# Altium schematic sheet MCX_Isolated_Mezzanine.SchDoc: DIO MCX 16 Isolated
size A3; Author: F.Świtakowski; CompanyName: WUT ISE; DrawnBy: F.Świtakowski; Organization: WUT ISE; Address1: PW ISE; Address2: Nowowiejska 15/19 00-665 Warsaw; DocumentNumber: 1; Revision: 2; SheetNumber: 1; SheetTotal: 2; ModifiedBy: -; CheckedDate: -; Title2: Mezzanine; DivGrp: WUT ISE; Designer: F.Świtakowski; ModifiedDate: -; ProjectName: Sensor Box
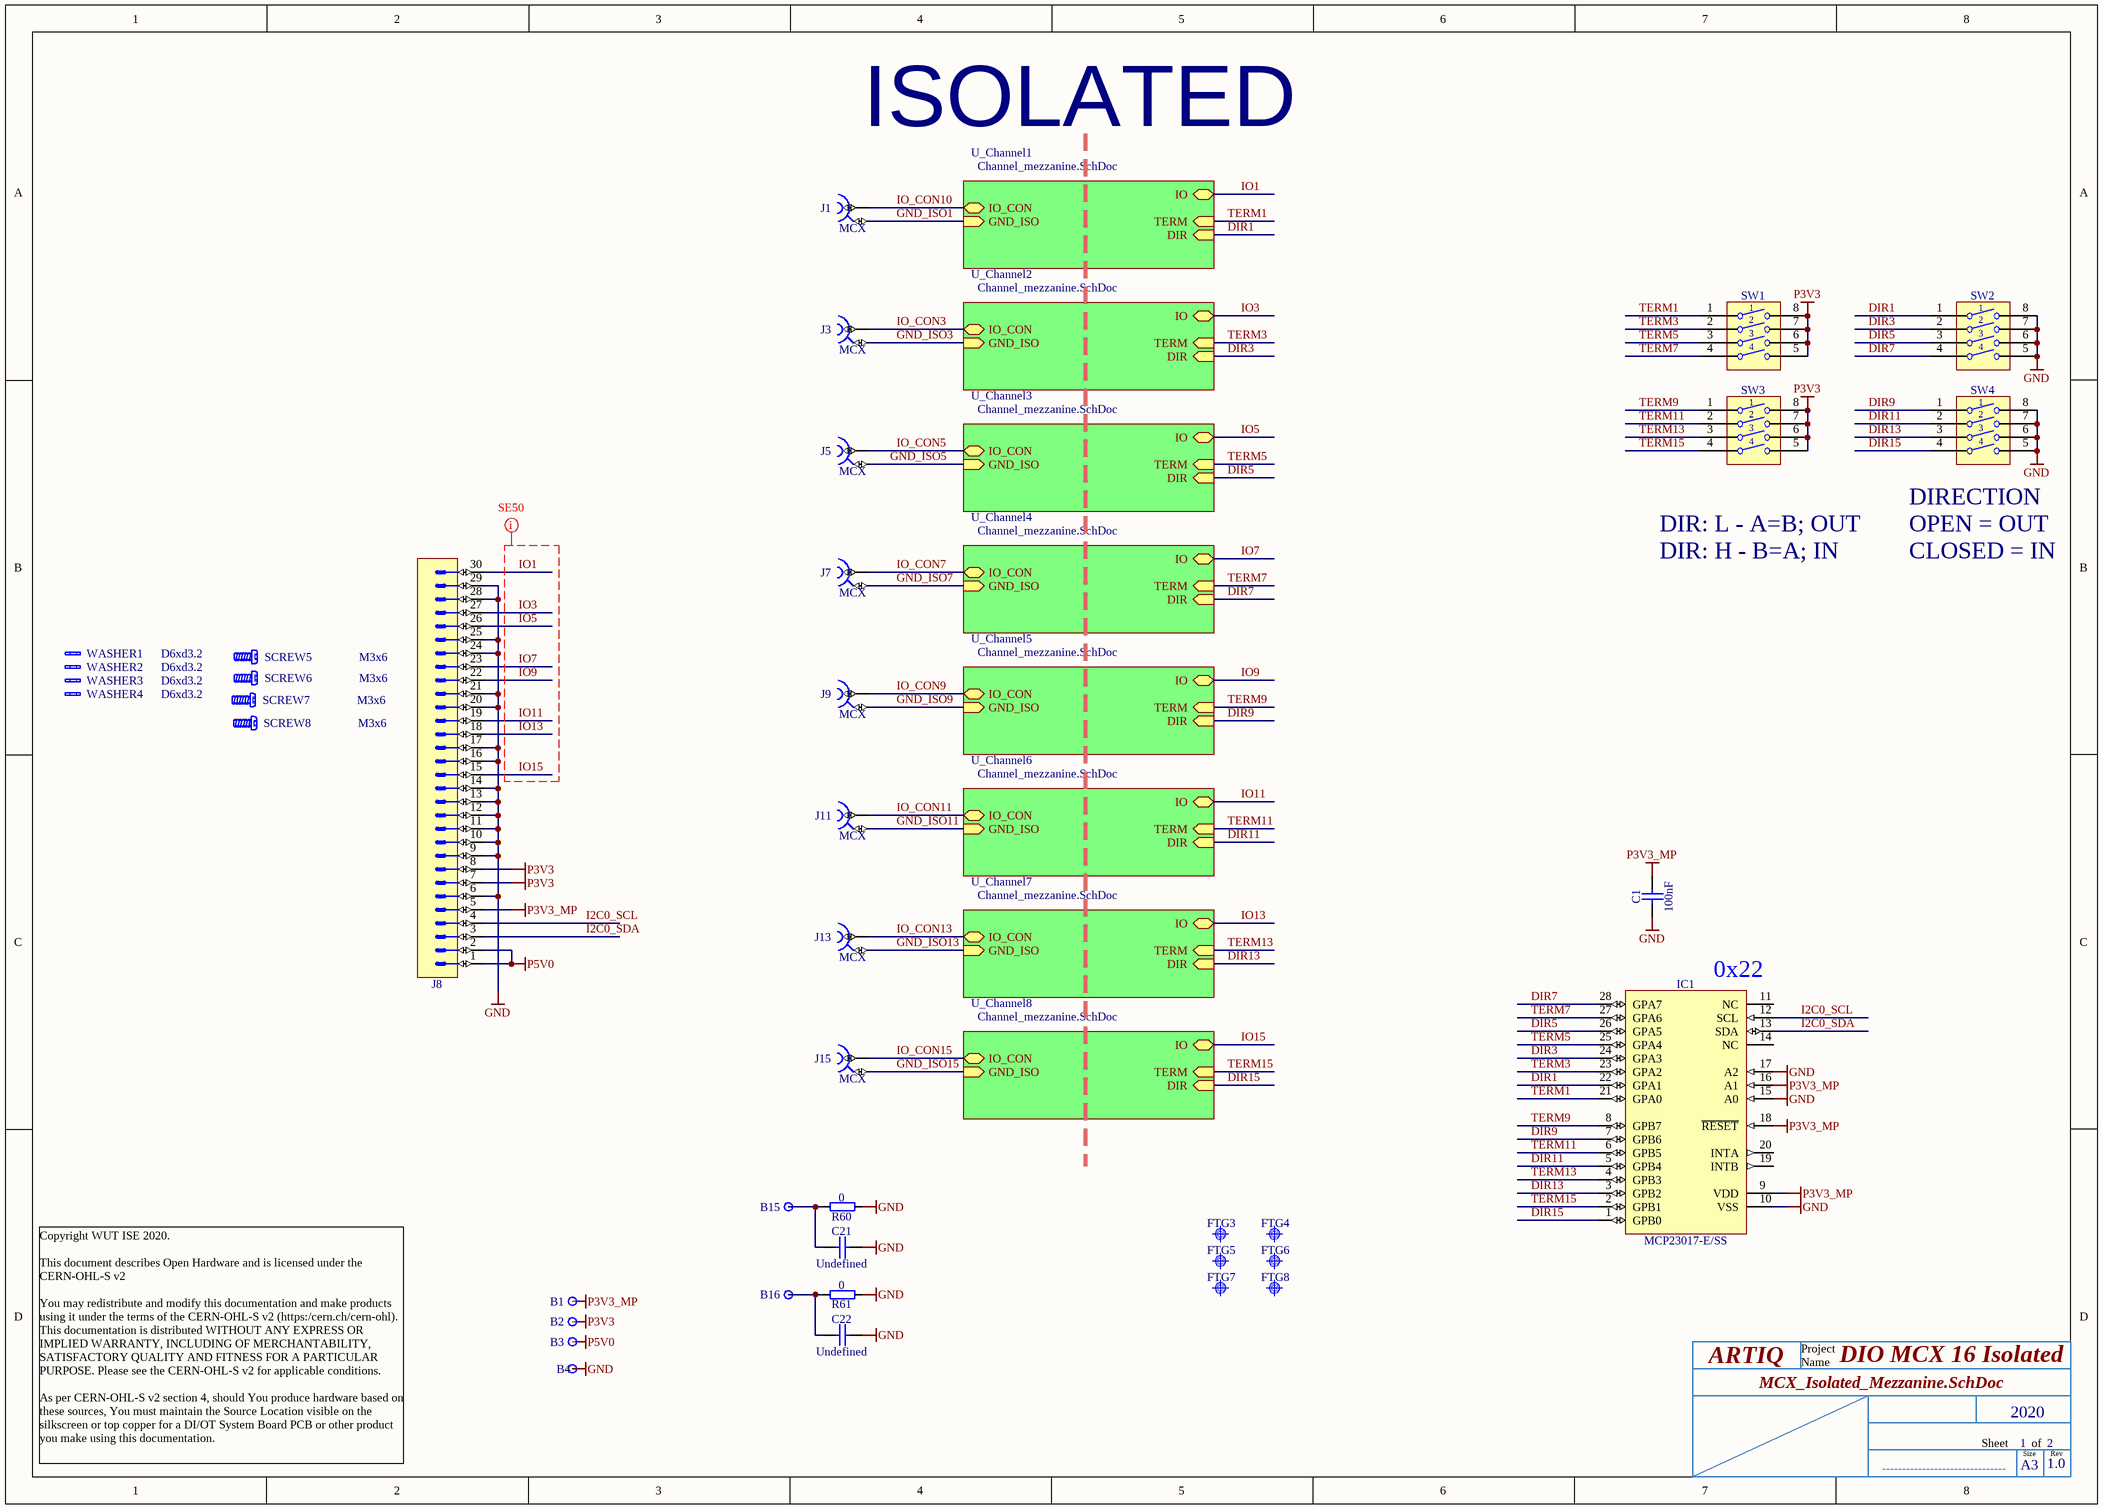
[diagram p0: MCX_Isolated_Mezzanine.SchDoc]

## Parts
B1  Plated Hole  [c130h60]  (value not drawn)
B2  Plated Hole  [c130h60]  (value not drawn)
B3  Plated Hole  [c130h60]  (value not drawn)
B4  Plated Hole  [c130h60]  (value not drawn)
B15  Plated Hole  [MTG270_500]  (value not drawn)
B16  Plated Hole  [MTG270_500]  (value not drawn)
C1  100nF  [CAPC1005X55N]
C21  Undefined  [CAPC2012X135N]
C22  Undefined  [CAPC2012X135N]
FTG3  Use only in PCB  [FIDUCIAL_TOP_S100-200]  (value not drawn)
FTG4  Use only in PCB  [FIDUCIAL_TOP_C100-200]  (value not drawn)
FTG5  Use only in PCB  [FIDUCIAL_TOP_S100-200]  (value not drawn)
FTG6  Use only in PCB  [FIDUCIAL_TOP_C100-200]  (value not drawn)
FTG7  Use only in PCB  [FIDUCIAL_TOP_C100-200]  (value not drawn)
FTG8  Use only in PCB  [FIDUCIAL_TOP_S100-200]  (value not drawn)
IC1  MCP23017-E/SS  [SOP65P780X200-28N]
J1  MCX  [BEL_133-3701-801]
J3  MCX  [BEL_133-3701-801]
J5  MCX  [BEL_133-3701-801]
J7  MCX  [BEL_133-3701-801]
J8  AMPMODU  [TYCO_1-215307-5]  (value not drawn)
J9  MCX  [BEL_133-3701-801]
J11  MCX  [BEL_133-3701-801]
J13  MCX  [BEL_133-3701-801]
J15  MCX  [BEL_133-3701-801]
R60  0  [RESC1608X55N]
R61  0  [RESC1608X55N]
SCREW5  M3x6  [BOSSARD_BN5687-3061605_v]
SCREW6  M3x6  [BOSSARD_BN5687-3061605_v]
SCREW7  M3x6  [BOSSARD_BN5687-3061605_v]
SCREW8  M3x6  [BOSSARD_BN5687-3061605_v]
SW1  Switch  [SW_OMRON_A6S-4102-H]  (value not drawn)
SW2  Switch  [SW_OMRON_A6S-4102-H]  (value not drawn)
SW3  Switch  [SW_OMRON_A6S-4102-H]  (value not drawn)
SW4  Switch  [SW_OMRON_A6S-4102-H]  (value not drawn)
WASHER1  D6xd3.2  [BOSSARD_B3/6/0.3/BN1976_v]
WASHER2  D6xd3.2  [BOSSARD_B3/6/0.3/BN1976_v]
WASHER3  D6xd3.2  [BOSSARD_B3/6/0.3/BN1976_v]
WASHER4  D6xd3.2  [BOSSARD_B3/6/0.3/BN1976_v]

## Sub-sheets
U_Channel1 = Channel_mezzanine.SchDoc: IO (bidir), TERM (in), DIR (in), IO_CON (bidir), GND_ISO (in)
U_Channel2 = Channel_mezzanine.SchDoc: IO (bidir), TERM (in), DIR (in), IO_CON (bidir), GND_ISO (in)
U_Channel3 = Channel_mezzanine.SchDoc: IO (bidir), TERM (in), DIR (in), IO_CON (bidir), GND_ISO (in)
U_Channel4 = Channel_mezzanine.SchDoc: IO (bidir), TERM (in), DIR (in), IO_CON (bidir), GND_ISO (in)
U_Channel5 = Channel_mezzanine.SchDoc: IO (bidir), TERM (in), DIR (in), IO_CON (bidir), GND_ISO (in)
U_Channel6 = Channel_mezzanine.SchDoc: IO (bidir), TERM (in), DIR (in), IO_CON (bidir), GND_ISO (in)
U_Channel7 = Channel_mezzanine.SchDoc: IO (bidir), TERM (in), DIR (in), IO_CON (bidir), GND_ISO (in)
U_Channel8 = Channel_mezzanine.SchDoc: IO (bidir), TERM (in), DIR (in), IO_CON (bidir), GND_ISO (in)

## Nets
GND: B4.1 C1.1 C21.2 C22.2 IC1.10(VSS) IC1.15(A0) IC1.17(A2) J8.6 J8.9 J8.10 J8.11 J8.12 J8.13 J8.14 J8.16 J8.17 J8.20 J8.21 J8.24 J8.25 J8.28 J8.29 R60.1 R61.1 SW2.5 SW2.6 SW2.7 SW2.8 SW4.5 SW4.6 SW4.7 SW4.8
P3V3: B2.1 J8.7 J8.8 SW1.5 SW1.6 SW1.7 SW1.8 SW3.5 SW3.6 SW3.7 SW3.8
P3V3_MP: B1.1 C1.2 IC1.9(VDD) IC1.16(A1) IC1.18(~{RESET}) J8.5
P5V0: B3.1 J8.1 J8.2
DIR1: IC1.22(GPA1) SW2.1 ; sheet U_Channel1/DIR
DIR3: IC1.24(GPA3) SW2.2 ; sheet U_Channel2/DIR
DIR5: IC1.26(GPA5) SW2.3 ; sheet U_Channel3/DIR
DIR7: IC1.28(GPA7) SW2.4 ; sheet U_Channel4/DIR
DIR9: IC1.7(GPB6) SW4.1 ; sheet U_Channel5/DIR
DIR11: IC1.5(GPB4) SW4.2 ; sheet U_Channel6/DIR
DIR13: IC1.3(GPB2) SW4.3 ; sheet U_Channel7/DIR
DIR15: IC1.1(GPB0) SW4.4 ; sheet U_Channel8/DIR
GND_ISO1: J1.2 ; sheet U_Channel1/GND_ISO
GND_ISO3: J3.2 ; sheet U_Channel2/GND_ISO
GND_ISO5: J5.2 ; sheet U_Channel3/GND_ISO
GND_ISO7: J7.2 ; sheet U_Channel4/GND_ISO
GND_ISO9: J9.2 ; sheet U_Channel5/GND_ISO
GND_ISO11: J11.2 ; sheet U_Channel6/GND_ISO
GND_ISO13: J13.2 ; sheet U_Channel7/GND_ISO
GND_ISO15: J15.2 ; sheet U_Channel8/GND_ISO
I2C0_SCL: IC1.12(SCL) J8.4
I2C0_SDA: IC1.13(SDA) J8.3
IO1: J8.30 ; sheet U_Channel1/IO
IO3: J8.27 ; sheet U_Channel2/IO
IO5: J8.26 ; sheet U_Channel3/IO
IO7: J8.23 ; sheet U_Channel4/IO
IO9: J8.22 ; sheet U_Channel5/IO
IO11: J8.19 ; sheet U_Channel6/IO
IO13: J8.18 ; sheet U_Channel7/IO
IO15: J8.15 ; sheet U_Channel8/IO
IO_CON3: J3.1 ; sheet U_Channel2/IO_CON
IO_CON5: J5.1 ; sheet U_Channel3/IO_CON
IO_CON7: J7.1 ; sheet U_Channel4/IO_CON
IO_CON9: J9.1 ; sheet U_Channel5/IO_CON
IO_CON10: J1.1 ; sheet U_Channel1/IO_CON
IO_CON11: J11.1 ; sheet U_Channel6/IO_CON
IO_CON13: J13.1 ; sheet U_Channel7/IO_CON
IO_CON15: J15.1 ; sheet U_Channel8/IO_CON
TERM1: IC1.21(GPA0) SW1.1 ; sheet U_Channel1/TERM
TERM3: IC1.23(GPA2) SW1.2 ; sheet U_Channel2/TERM
TERM5: IC1.25(GPA4) SW1.3 ; sheet U_Channel3/TERM
TERM7: IC1.27(GPA6) SW1.4 ; sheet U_Channel4/TERM
TERM9: IC1.8(GPB7) SW3.1 ; sheet U_Channel5/TERM
TERM11: IC1.6(GPB5) SW3.2 ; sheet U_Channel6/TERM
TERM13: IC1.4(GPB3) SW3.3 ; sheet U_Channel7/TERM
TERM15: IC1.2(GPB1) SW3.4 ; sheet U_Channel8/TERM
NetB15_1: B15.1 C21.1 R60.2
NetB16_1: B16.1 C22.1 R61.2

Not connected (* = marked no-connect by the designer): IC1 11(NC) 14(NC) 19(INTB) 20(INTA)

## Layout directives
net class SE50; rule Width Constraint [Pref Width = 0.35mm    Min Width = 0.3mm    Max Width = 0.35mm]: IO1, IO3, IO5, IO7, IO9, IO11, IO13, IO15

## Notes on the sheet
- ISOLATED
- (near SW4) DIRECTION
- DIR: L - A=B; OUT
- DIR: H - B=A; IN
- OPEN = OUT
- CLOSED = IN
- (near IC1) 0x22
- ARTIQ
- Project
- Name
- Copyright WUT ISE 2020.
  This document describes Open Hardware and is licensed under the CERN-OHL-S v2
  You may redistribute and modify this documentation and make products using it under the terms of the CERN-OHL-S v2 (https:/cern.ch/cern-ohl). This documentation is distributed WITHOUT ANY EXPRESS OR IMPLIED WARRANTY, INCLUDING OF MERCHANTABILITY, SATISFACTORY QUALITY AND FITNESS FOR A PARTICULAR PURPOSE. Please see the CERN-OHL-S v2 for applicable conditions.
  As per CERN-OHL-S v2 section 4, should You produce hardware based on these sources, You must maintain the Source Location visible on the silkscreen or top copper for a DI/OT System Board PCB or other product you make using this documentation.
- Sheet
- 2020
- Size
- A3
- of
- Rev
- -------------------------------
- 1.0

## Library data of the parts
B1-B4 = PLATED_HOLE0.6_PAD1.3: Single Terminal Socket; Part Description: Plated Through Hole: Hole Dia.=0.6mm Pad Dia.=1.3mm; Mounted: No; Part Number: PLATED_HOLE0.6_PAD1.3; Component Kind: Standard (No BOM); Component Type: Standard (No BOM); Pin Count: 1; Family: Plated Hole; Socket: No; SMD: No; Sense: No; Status: None; ComponentHeight: 0mm; HelpURL: Undefined; Author: CERN DEM MR; CreateDate: 02.03.2016; LatestRevisionDate: 02.03.2016; PackageDescription: Plated Through Hole: Hole Dia.=0.6mm Pad Dia.=1.3mm
B15 B16 = PLATED_HOLE2.7_PAD5.0: Single Terminal Socket; Part Description: Plated Through Hole: Hole Dia.=2.7mm Pad Dia.=5.0mm; Mounted: No; Part Number: PLATED_HOLE2.7_PAD5.0; Component Kind: Standard (No BOM); Component Type: Standard (No BOM); Pin Count: 1; Family: Plated Hole; Socket: No; SMD: No; Sense: No; Status: None; ComponentHeight: 0mm; HelpURL: Undefined; Author: CERN DEM JMW; CreateDate: 27.09.2011; LatestRevisionDate: 27.09.2011; PackageDescription: Plated Through Hole: Hole Dia.=2.7mm Pad Dia.=5.0mm
C1 = CC0402_100NF_50V_10%_X7R: Non-polarised capacitor; Part Description: SMD Multilayer Chip Ceramic Capacitor; Manufacturer: GENERIC; Manufacturer1 Part Number: GRM155R71H104KE14D; Voltage: 50V; TC: X7R; Tolerance: ±10%; Part Number: CC0402_100NF_50V_10%_X7R; Component Kind: Standard; Component Type: Standard; Pin Count: 2; Value: 100nF; Status: None; Manufacturer Part Number: CC0402_100NF_50V_10%_X7R; Case: 0402; Mounted: Yes; Socket: No; SMD: Yes; Sense: No; Manufacturer1 Example: MURATA; Manufacturer1 ComponentHeight: 0.55mm; HelpURL: \\cern.ch\dfs\Applications\Altium\Datasheets\CC0402_MURATA_GRM155R71H104KE14D.pdf; Author: CERN DEM MR; CreateDate: 30.06.2017; LatestRevisionDate: 30.06.2017
C21 C22 = CC0805_NO-VALUE: Non-polarised capacitor; Part Description: Reserved Footprint For 0805(2012) Chip Ceramic Capacitor; Mounted: No; Part Number: CC0805_NO-VALUE; Component Kind: Standard; Component Type: Standard; Pin Count: 2; Value: Undefined; Status: None; Manufacturer: Undefined; Manufacturer Part Number: CC0805_NO-VALUE; Case: 0805; Socket: No; SMD: Yes; Sense: No; Manufacturer1 ComponentHeight: 1.35mm; HelpURL: Undefined; Author: CERN DEM JLC; CreateDate: 10.12.2008; LatestRevisionDate: 11.09.2013
FTG3 FTG5 FTG8 = FIDUCIAL_TARGET_S100-200: Fiducial Target; Part Description: Square Fiducial Target, Top Layer, 1.0mm, Top Solder 2.0mm, Keepout =2.0mm; Mounted: No; Part Number: FIDUCIAL_TARGET_S100-200; Component Kind: Standard (No BOM); Component Type: Standard (No BOM); Pin Count: 1; Family: Fiducial; Socket: No; SMD: Yes; Sense: No; Status: None; ComponentHeight: 0mm; HelpURL: Undefined; Author: CERN DEM JLC; CreateDate: 09.02.2010; LatestRevisionDate: 04.04.2012; PackageDescription: Square Fiducial Target, Top Layer, 1.0mm, Top Solder 2.0mm, Keepout =2.0mm
FTG4 FTG6 FTG7 = FIDUCIAL_TARGET_C100-200: Fiducial Target; Part Description: Round Fiducial Target, Top Layer, 1.0mm, Top Solder 2.0mm, Keepout =2.0mm; Mounted: No; Part Number: FIDUCIAL_TARGET_C100-200; Component Kind: Standard (No BOM); Component Type: Standard (No BOM); Pin Count: 1; Family: Fiducial; Socket: No; SMD: Yes; Sense: No; Status: None; ComponentHeight: 0mm; HelpURL: Undefined; Author: CERN DEM JLC; CreateDate: 09.02.2010; LatestRevisionDate: 04.04.2012; PackageDescription: Round Fiducial Target, Top Layer, 1.0mm, Top Solder 2.0mm, Keepout =2.0mm
IC1 = MCP23017-E/SS: 16-bit I/O Port Expander With Serial Interface; Manufacturer: MICROCHIP TECHNOLOGY; PressFit: No; Bonding: No; Part Number: MCP23017-E/SS; Component Kind: Standard; Component Type: Standard; Device: MCP23017-E/SS; PackageDescription: SOP, 0.65mm Pitch; 28 pin, 5.30mm W X 10.20mm L X 2.00mm H body, IPC Medium Density; Part Description: 16-bit I/O Port Expander With Serial Interface; Manufacturer Part Number: MCP23017-E/SS; Pin Count: 28; Case: SSOP28; Mounted: Yes; Socket: No; SMD: Yes; Sense: No; ComponentHeight: 2mm; Author: CERN DEM JLC; HelpURL: \\cern.ch\dfs\Applications\Altium\Datasheets\MCP23017-E-SS.pdf; CreateDate: 17/01/2011; LatestRevisionDate: 17/01/2011
J1 J3 J5 J7 J9 J11 J13 J15 = BELFUSE_133-3701-801: Part Description: MCX Jack, End Launch Straight Receptacle - Tab Contact, For 1.6mm Thickness Board; Manufacturer: BEL; PressFit: No; Part Number: BELFUSE_133-3701-801; Component Kind: Standard; Component Type: Standard; Pin Count: 2; Family: MCX; Mounted: Yes; Socket: No; SMD: No; Sense: No; Status: None; Manufacturer Part Number: 133-3701-801; ComponentHeight: 3.53mm; HelpURL: \\cern.ch\dfs\Applications\Altium\Datasheets\BEL_133-3701-801.pdf; Author: CERN DEM MR; CreateDate: 21.10.2019; LatestRevisionDate: 21.10.2019
J8 = CON_2x15_2.54_female_V_mirror: Connector 2.54mm, 30 pin female, vertical, 7mm, AMPMODU HV-100/HV-190; Part Description: 34 Contacts, Dual Row Vertical Low Profile IDC Shrouded Header, with Long Eject Latch; Manufacturer: TYCO ELECTRONICS; Manufacturer Part Number: 1-215307-5; PressFit: No; Part Number: TYCO_1-215307-5; Component Kind: Standard; Component Type: Standard; Pin Count: 30; Family: AMPMODU; Mounted: Yes; Socket: No; SMD: No; Sense: No; Status: None; ComponentHeight: 22.86mm; HelpURL: \\cern.ch\dfs\Applications\Altium\Datasheets\TYCO_3-1761606-1.pdf; Author: GK; CreateDate: 05.10.2015; LatestRevisionDate: 05.10.2015
R60 R61 = R0603_0R_JUMPER: Resistor; Part Description: 1A (0.05R Max DC Resistance) Zero Ohm Jumper; Manufacturer: GENERIC; Manufacturer1 Part Number: NRC06Z0; PressFit: No; Part Number: R0603_0R_JUMPER; Component Kind: Standard; Component Type: Standard; Pin Count: 2; Value: 0; Status: Preferred; Manufacturer Part Number: R0603_0R_JUMPER; Case: 0603; Mounted: Yes; Sense: No; Socket: No; SMD: Yes; Manufacturer1 Example: NIC COMPONENT; Manufacturer1 ComponentHeight: 0.55mm; HelpURL: \\cern.ch\dfs\Applications\Altium\Datasheets\R0603_NIC_NRC.pdf; Author: CERN DEM JLC; CreateDate: 03.12.2007; LatestRevisionDate: 13.03.2008
SCREW5-SCREW8 = BOSSARD_BN5687-3061605_v: Screw; Part Description: M3 L=6mm Hexalobular Socket Pan Head Screw, Fully Threaded, Stainless Steel A2; Manufacturer Part Number: BN5687 Art.3061605; PressFit: No; Part Number: BOSSARD_BN5687-3061605_v; Component Kind: Standard; Component Type: Mechanical; Pin Count: 0; PackageDescription: M3 L=6mm Hexalobular Socket Pan Head Screw, Fully Threaded - Stainless Steel A2; Mounted: Yes; Socket: No; SMD: No; Sense: No; Status: None; Value: M3x6; Manufacturer: BOSSARD; ComponentHeight: 2.4mm; HelpURL: \\cern.ch\dfs\Applications\Altium\Datasheets\BOSSARD_BN5687-3061605.pdf; Author: CERN DEM JLC; CreateDate: 15.01.2013; LatestRevisionDate: 15.01.2013
SW1-SW4 = SW_OMRON_A6S-4102-H: 4 Ways SPST DIP Switch; Part Description: 4 Ways SPST DIP Switch, White Flat Actuator with Seal Tape, Contact Rating 25mA 24VDC; Manufacturer: OMRON; PressFit: No; Part Number: SW_OMRON_A6S-4102-H; Component Kind: Standard; Component Type: Standard; Pin Count: 8; PackageDescription: Pitch 2.54mm, Body 11.3x6.4mm, 4 Ways SPST Surface-Mounting DIP Switch, OMRON A6S-H; Family: Switch; Mounted: Yes; Socket: No; SMD: Yes; Sense: No; Status: None; Manufacturer Part Number: A6S-4102-H; ComponentHeight: 3.8mm; HelpURL: \\cern.ch\dfs\Applications\Altium\Datasheets\SW_OMRON_A6S-4102-H.pdf; Author: CERN DEM JMW; CreateDate: 25.09.2008; LatestRevisionDate: 25.09.2008
WASHER1-WASHER4 = MECH_Washer_M3x0.3x6: Washer, M3x0.3x6; Part Number: BOSSARD_B3/6/0.3/BN1976; Part Description: Flat Washer without Chamfer for M3 Screw, Steel; Manufacturer: BOSSARD; Manufacturer Part Number: B3/6/0.3/BN1976; PressFit: No; Component Kind: Standard; Component Type: Mechanical; Pin Count: 0; PackageDescription: Flat Washer without Chamfer for M3 Screw, steel; Mounted: Yes; Socket: No; SMD: No; Sense: No; Status: None; Value: D6xd3.2; ComponentHeight: 0.5mm; HelpURL: \\cern.ch\dfs\Applications\Altium\Datasheets\BOSSARD_BN1074-1404830.pdf; Author: GK; CreateDate: 08.03.2018; LatestRevisionDate: 08.03.2018